# Altium schematic sheet Processor_Interface.SchDoc
size 431 x 279 mm; Organization: ORGANIZATION; Address1: ADDRESS 1; Address2: ADDRESS 2; Address3: ADDRESS 3; Address4: ADDRESS 4; Revision: -; SheetNumber: 1; SheetTotal: 7; ENG_APP_DATE: --/--/--; DSN_APP_DATE: --/--/--; CHK_APP_DATE: --/--/--
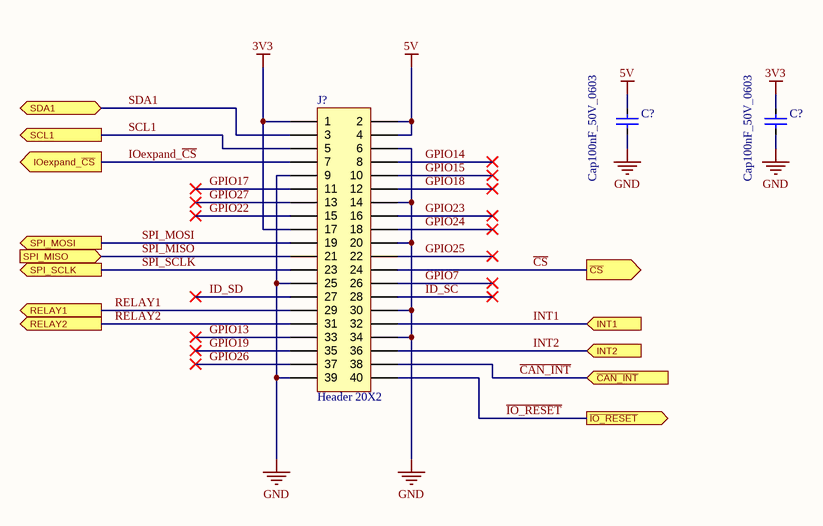
[diagram p0: Processor_Interface.SchDoc]

## Parts
(Parts that share a designator on the sheet are numbered #1, #2 ... from top to bottom, then left to right.)
C?#1  Cap100nF_50V_0603  [0603C_L]
C?#2  Cap100nF_50V_0603  [0603C_L]
J?  Header 20X2  [HDR2X20]

## Ports
INT1 (in), INT2 (in), IOexpand_~{CS} (out), RELAY1 (out), RELAY2 (out), SCL1 (out), SDA1 (bidir), SPI_MISO (in), SPI_MOSI (out), SPI_SCLK (out), ~{CAN_INT} (in), ~{CS} (out), ~{IO_RESET} (out)

## Nets
3V3: C?#2.2 J?.1 J?.17
5V: C?#1.2 J?.2 J?.4
GND: C?#1.1 C?#2.1 J?.6 J?.9 J?.14 J?.20 J?.25 J?.30 J?.34 J?.39
~{CAN_INT}: J?.38 ; port ~{CAN_INT}
~{IO_RESET}: J?.40 ; port ~{IO_RESET}
~{CS}: J?.24 ; port ~{CS}
GPIO7: J?.26
GPIO13: J?.33
GPIO14: J?.8
GPIO15: J?.10
GPIO17: J?.11
GPIO18: J?.12
GPIO19: J?.35
GPIO22: J?.15
GPIO23: J?.16
GPIO24: J?.18
GPIO25: J?.22
GPIO26: J?.37
GPIO27: J?.13
ID_SC: J?.28
ID_SD: J?.27
INT1: J?.32 ; port INT1
INT2: J?.36 ; port INT2
IOexpand_~{CS}: J?.7 ; port IOexpand_~{CS}
RELAY1: J?.29 ; port RELAY1
RELAY2: J?.31 ; port RELAY2
SCL1: J?.5 ; port SCL1
SDA1: J?.3 ; port SDA1
SPI_MISO: J?.21 ; port SPI_MISO
SPI_MOSI: J?.19 ; port SPI_MOSI
SPI_SCLK: J?.23 ; port SPI_SCLK

## Notes on the sheet
- DWG. NO.
- REV.
- SHT.
- THIS DOCUMENT AND THE DATA DISCLOSED HEREIN OR HEREWITH IS THE PROPERTY OF ALTIUM LIMITED AND MAY BE FREELY DISTRIBUTED IN WHOLE. NO RIGHTS ARE RESERVED OR EXPRESS OR IMPLIED WARANTEE GIVEN.
- REVISION
- DESCRIPTION
- DATE
- APPROVED
- ENG:
- DSN:
- APPROVALS
- PROJECT REVISION:
- www.altium.com <http://www.altium.com>
- DOCUMENT REVISION:
- 92037, La Jolla
- USA
- Altium Ltd.
- 4225 Executive Square
- CHK:
- REFERENCE DOCUMENTS
- DESIGN ITEM:
- TITLE
- VARIANT
- BOM:
- FAB DWG:
- PCB DWG:
- ASSY DWG:
- SCALE:
- SIZE
- B
- CAGE CODE
- FILE NAME
- DWG NO.
- SHEET
- OF
- REV

## Library data of the parts
C?#1 C?#2 = CMP-00119-2: Ceramic Capacitor, Multilayer, Ceramic, 50V, 80% +Tol, 20% -Tol, Y5V, -82/+22% TC, 0.1uF, Surface Mount, 0603; Value: 100nF; Multilayer: Yes; Packaging: Tape and Reel; Case/Package: 0603; Dielectric Material: Ceramic; Height: 0.8mm; Length: 1.6mm; Max Operating Temperature: 85°C; Min Operating Temperature: -30°C; Mounting Technology: Surface Mount; Pins: 2; RoHS Compliant: Yes; Termination: Wraparound; Voltage Rating: 50V; Width: 0.8mm; Capacitor Type: Ceramic; JESD-609 Code: e3; Package Shape: Rectangular; Package Style: SMTMeter; Rated DC Voltage (URdc): 50V; Reach SVHC Compliant: Yes; Temperature Characteristics Code: Y5V; Terminal Finish: Nickel; Tolerance  (fill in as +-): 20%; Tolerance (fill in as +-): 80%
J? = CMP-00208-1: Header, 20-Pin, Dual row; LatestRevisionDate: 17-Jul-2002; LatestRevisionNote: Re-released for DXP Platform.; Publisher: Altium Limited; Design Item ID: Header 20X2; Source: WCT.SchLib